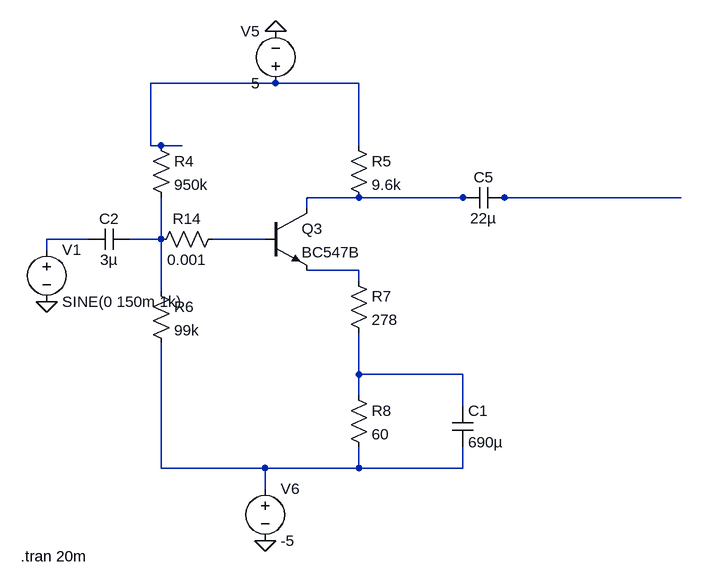
[diagram p0: schematic gain_stage.asc]
gain_stage.asc, the LTspice schematic file:
Version 4
SHEET 1 5540 740
WIRE 1312 -144 1120 -144
WIRE 1440 -144 1312 -144
WIRE 1120 -48 1120 -144
WIRE 1136 -48 1120 -48
WIRE 1168 -48 1136 -48
WIRE 1440 -48 1440 -144
WIRE 1440 32 1360 32
WIRE 1600 32 1440 32
WIRE 1616 32 1600 32
WIRE 1664 32 1648 32
WIRE 1936 32 1664 32
WIRE 1360 48 1360 32
WIRE 1024 96 960 96
WIRE 1136 96 1136 32
WIRE 1136 96 1088 96
WIRE 1296 96 1216 96
WIRE 960 112 960 96
WIRE 1440 144 1360 144
WIRE 1440 160 1440 144
WIRE 1136 176 1136 96
WIRE 1440 304 1440 240
WIRE 1600 304 1440 304
WIRE 1440 336 1440 304
WIRE 1600 352 1600 304
WIRE 1136 448 1136 256
WIRE 1296 448 1136 448
WIRE 1440 448 1440 416
WIRE 1440 448 1296 448
WIRE 1600 448 1600 416
WIRE 1600 448 1440 448
WIRE 1296 480 1296 448
FLAG 1312 -224 0
FLAG 1296 560 0
FLAG 960 192 0
SYMBOL res 1120 -64 R0
SYMATTR InstName R4
SYMATTR Value 950k
SYMBOL res 1424 -64 R0
SYMATTR InstName R5
SYMATTR Value 9.6k
SYMBOL res 1120 160 R0
SYMATTR InstName R6
SYMATTR Value 99k
SYMBOL res 1424 144 R0
SYMATTR InstName R7
SYMATTR Value 278
SYMBOL res 1424 320 R0
SYMATTR InstName R8
SYMATTR Value 60
SYMBOL cap 1584 352 R0
SYMATTR InstName C1
SYMATTR Value 690µ
SYMBOL cap 1088 80 R90
WINDOW 0 0 32 VBottom 2
WINDOW 3 32 32 VTop 2
SYMATTR InstName C2
SYMATTR Value 3µ
SYMBOL voltage 1312 -128 R180
WINDOW 0 24 96 Left 2
WINDOW 3 24 16 Left 2
WINDOW 123 0 0 Left 0
WINDOW 39 0 0 Left 0
SYMATTR InstName V5
SYMATTR Value 5
SYMBOL voltage 1296 464 R0
WINDOW 123 0 0 Left 0
WINDOW 39 0 0 Left 0
SYMATTR InstName V6
SYMATTR Value -5
SYMBOL npn 1296 48 R0
SYMATTR InstName Q3
SYMATTR Value BC547B
SYMBOL cap 1664 16 R90
WINDOW 0 0 32 VBottom 2
WINDOW 3 32 32 VTop 2
SYMATTR InstName C5
SYMATTR Value 22µ
SYMBOL res 1232 80 R90
WINDOW 0 0 56 VBottom 2
WINDOW 3 32 56 VTop 2
SYMATTR InstName R14
SYMATTR Value 0.001
SYMBOL voltage 960 96 R0
WINDOW 123 0 0 Left 0
WINDOW 39 0 0 Left 0
SYMATTR InstName V1
SYMATTR Value SINE(0 150m 1k)
TEXT 920 584 Left 2 !.tran 20m

The netlist it stands for:
* gain_stage.asc
R4 N001 N005 950k
R5 N001 N002 9.6k
R6 N005 N009 99k
R7 N007 N008 278
R8 N008 N009 60
C1 N008 N009 690µ
C2 N005 N004 3µ
V5 N001 0 5
V6 N009 0 -5
Q3 N002 N006 N007 0 BC547B
C5 N003 N002 22µ
R14 N006 N005 0.001
V1 N004 0 SINE(0 150m 1k)
.model NPN NPN
.model PNP PNP
.lib standard.bjt
.tran 20m
.backanno
.end